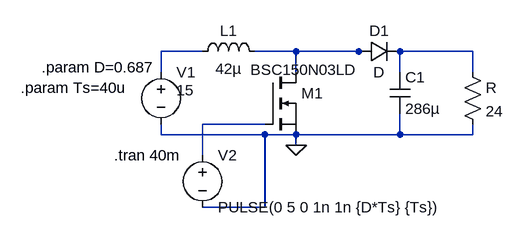
[diagram p0: schematic project_15Vsupply.asc]
project_15Vsupply.asc, the LTspice schematic file:
Version 4
SHEET 1 880 680
WIRE 0 64 -64 64
WIRE 144 64 80 64
WIRE 240 64 144 64
WIRE 256 64 240 64
WIRE 416 64 304 64
WIRE -64 96 -64 64
WIRE 144 96 144 64
WIRE 304 96 304 64
WIRE 416 96 416 64
WIRE 96 176 0 176
WIRE -64 192 -64 176
WIRE 96 192 -64 192
WIRE 144 192 96 192
WIRE 304 192 304 160
WIRE 304 192 144 192
WIRE 416 192 416 176
WIRE 416 192 304 192
WIRE 144 208 144 192
WIRE 0 224 0 176
WIRE 96 304 96 192
WIRE 96 304 0 304
FLAG 144 208 0
SYMBOL voltage -64 80 R0
WINDOW 123 0 0 Left 0
WINDOW 39 0 0 Left 0
WINDOW 3 24 44 Left 2
SYMATTR Value 15
SYMATTR InstName V1
SYMBOL ind -16 80 R270
WINDOW 0 32 56 VTop 2
WINDOW 3 5 56 VBottom 2
SYMATTR InstName L1
SYMATTR Value 42µ
SYMBOL nmos 96 96 R0
WINDOW 3 -22 -4 Left 2
SYMATTR Value BSC150N03LD
SYMATTR InstName M1
SYMBOL diode 240 80 R270
WINDOW 0 32 32 VTop 2
WINDOW 3 0 32 VBottom 2
SYMATTR InstName D1
SYMBOL res 400 80 R0
SYMATTR InstName R
SYMATTR Value 24
SYMBOL voltage 0 208 R0
WINDOW 123 0 0 Left 0
WINDOW 39 0 0 Left 0
SYMATTR InstName V2
SYMATTR Value PULSE(0 5 0 1n 1n {D*Ts} {Ts})
SYMBOL cap 288 96 R0
SYMATTR InstName C1
SYMATTR Value 286µ
TEXT -136 224 Left 2 !.tran 40m
TEXT -248 88 Left 2 !.param D=0.687
TEXT -280 120 Left 2 !.param Ts=40u

The netlist it stands for:
* project_15Vsupply.asc
V1 N001 0 15
L1 N001 N002 42µ
M1 N002 N004 0 0 BSC150N03LD
D1 N002 N003 D
R N003 0 24
V2 N004 0 PULSE(0 5 0 1n 1n {D*Ts} {Ts})
C1 N003 0 286µ
.model D D
.lib standard.dio
.model NMOS NMOS
.model PMOS PMOS
.lib standard.mos
.tran 40m
.param D=0.687
.param Ts=40u
.backanno
.end